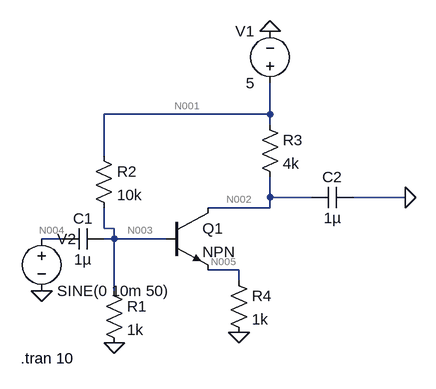
[diagram p0: schematic Voltage_divider_amplifer.asc]
Voltage_divider_amplifer.asc, the LTspice schematic file:
Version 4
SHEET 1 880 680
WIRE 224 -16 224 -64
WIRE 224 -16 -32 -16
WIRE 224 0 224 -16
WIRE -32 48 -32 -16
WIRE 224 112 224 80
WIRE 288 112 224 112
WIRE 432 112 352 112
WIRE 224 128 224 112
WIRE 224 128 128 128
WIRE -32 160 -32 128
WIRE -16 160 -32 160
WIRE -96 176 -128 176
WIRE -16 176 -16 160
WIRE -16 176 -32 176
WIRE 64 176 -16 176
WIRE 176 224 128 224
WIRE 176 240 176 224
WIRE -16 256 -16 176
FLAG 224 -144 0
FLAG -16 336 0
FLAG 176 320 0
FLAG -128 256 0
FLAG 432 112 0
SYMBOL npn 64 128 R0
SYMATTR InstName Q1
SYMBOL res -32 240 R0
SYMATTR InstName R1
SYMATTR Value 1k
SYMBOL res -48 32 R0
SYMATTR InstName R2
SYMATTR Value 10k
SYMBOL res 208 -16 R0
SYMATTR InstName R3
SYMATTR Value 4k
SYMBOL res 160 224 R0
SYMATTR InstName R4
SYMATTR Value 1k
SYMBOL voltage 224 -48 R180
WINDOW 0 24 96 Left 2
WINDOW 3 24 16 Left 2
WINDOW 123 0 0 Left 0
WINDOW 39 0 0 Left 0
SYMATTR InstName V1
SYMATTR Value 5
SYMBOL voltage -128 160 R0
WINDOW 123 0 0 Left 0
WINDOW 39 0 0 Left 0
SYMATTR InstName V2
SYMATTR Value SINE(0 10m 50)
SYMBOL cap -32 160 R90
WINDOW 0 0 32 VBottom 2
WINDOW 3 32 32 VTop 2
SYMATTR InstName C1
SYMATTR Value 1µ
SYMBOL cap 352 96 R90
WINDOW 0 0 32 VBottom 2
WINDOW 3 32 32 VTop 2
SYMATTR InstName C2
SYMATTR Value 1µ
TEXT -160 360 Left 2 !.tran 10

The netlist it stands for:
* Voltage_divider_amplifer.asc
Q1 N002 N003 N005 0 NPN
R1 N003 0 1k
R2 N001 N003 10k
R3 N001 N002 4k
R4 N005 0 1k
V1 N001 0 5
V2 N004 0 SINE(0 10m 50)
C1 N003 N004 1µ
C2 0 N002 1µ
.model NPN NPN
.model PNP PNP
.lib standard.bjt
.tran 10
.backanno
.end

* Results of the author's LTspice run, read from the files saved beside the schematic
* Operating Point, zero values left out:
*   V(n002) = 5 V
*   V(n003) = 454.5 mV
*   V(n005) = 4.33 µV
*   V(n001) = 5 V
*   Ic(Q1) = 4.291 nA
*   Ib(Q1) = 38.78 pA
*   Ie(Q1) = -4.33 nA
*   I(R1) = 454.5 µA
*   I(R2) = 454.5 µA
*   I(R3) = 4.291 nA
*   I(R4) = 4.33 nA
*   I(V1) = -454.5 µA
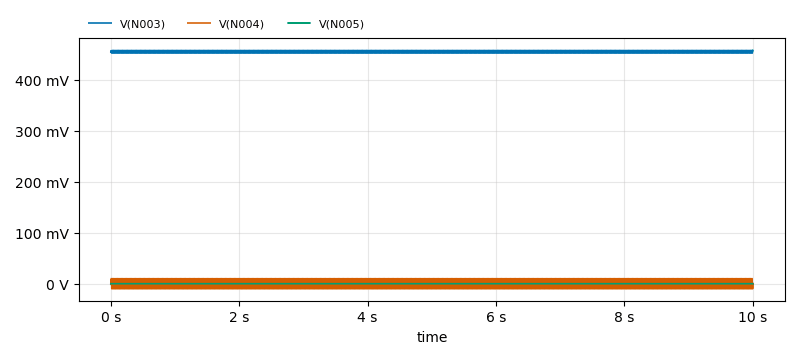
[diagram p1: Transient Analysis of Voltage_divider_amplifer.asc, plotted from the saved traces]
* Transient Analysis, 1 run:
*   V(N003): min 451.9 mV, max 457.2 mV, average 454.5 mV, rms 454.5 mV, last 457.2 mV
*   V(N004): min -9.995 mV, max 9.995 mV, average 11.15 nV, rms 7.188 mV, last 0 V
*   V(N005): min 3.912 µV, max 4.801 µV, average 4.341 µV, rms 4.352 µV, last 4.801 µV